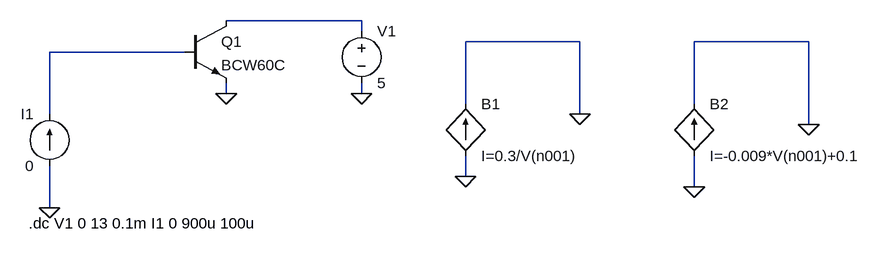
[diagram p0: schematic task2.asc]
task2.asc, the LTspice schematic file:
Version 4
SHEET 1 1300 680
WIRE 448 96 240 96
WIRE 448 112 448 96
WIRE 784 128 608 128
WIRE 1136 128 960 128
WIRE 176 144 -32 144
WIRE 240 208 240 192
WIRE 448 208 448 192
WIRE 608 224 608 128
WIRE 960 224 960 128
WIRE -32 240 -32 144
WIRE 784 240 784 128
WIRE 1136 256 1136 128
WIRE 608 336 608 304
WIRE 960 352 960 304
WIRE -32 384 -32 320
FLAG -32 384 0
FLAG 240 208 0
FLAG 448 208 0
FLAG 608 336 0
FLAG 784 240 0
FLAG 960 352 0
FLAG 1136 256 0
SYMBOL npn 176 96 R0
SYMATTR InstName Q1
SYMATTR Value BCW60C
SYMBOL current -32 320 R180
WINDOW 0 24 80 Left 2
WINDOW 3 24 0 Left 2
WINDOW 123 0 0 Left 0
WINDOW 39 0 0 Left 0
SYMATTR InstName I1
SYMATTR Value 0
SYMBOL voltage 448 96 R0
WINDOW 123 0 0 Left 0
WINDOW 39 0 0 Left 0
SYMATTR InstName V1
SYMATTR Value 5
SYMBOL bi2 608 224 R0
SYMATTR InstName B1
SYMATTR Value I=0.3/V(n001)
SYMBOL bi2 960 224 R0
SYMATTR InstName B2
SYMATTR Value I=-0.009*V(n001)+0.1
TEXT -64 408 Left 2 !.dc V1 0 13 0.1m I1 0 900u 100u

The netlist it stands for:
* task2.asc
Q1 N001 N002 0 0 BCW60C
I1 0 N002 0
V1 N001 0 5
B1 0 0 I=0.3/V(n001)
B2 0 0 I=-0.009*V(n001)+0.1
.model NPN NPN
.model PNP PNP
.lib standard.bjt
.dc V1 0 13 0.1m I1 0 900u 100u
.backanno
.end